# EAGLE design LM335_LTC (EAGLE 9.6.2)
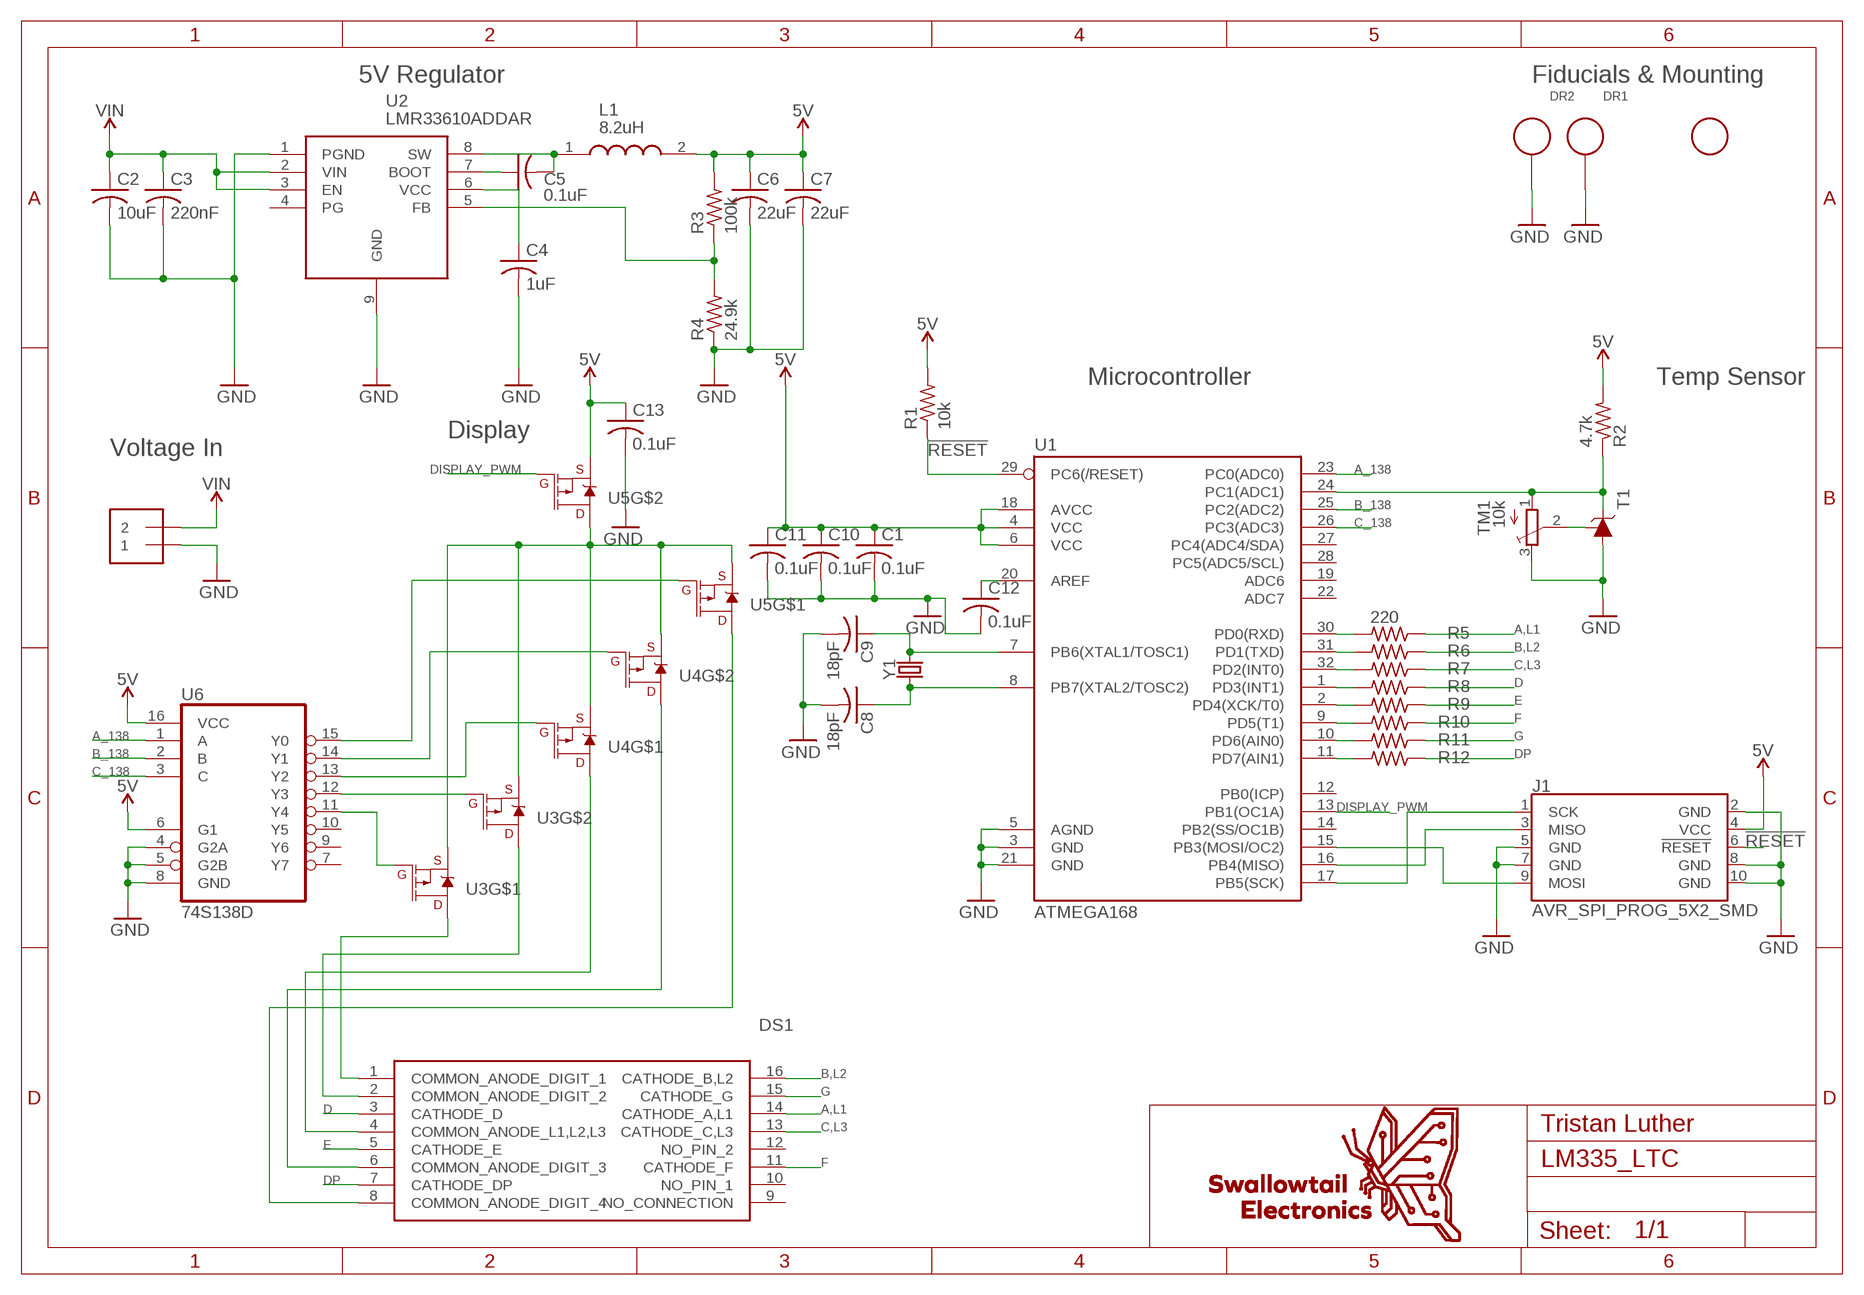
[diagram p0: schematic, sheet 1]

## Parts
C1  0.1uF  C-USC0805  [C0805]
C2  10uF  C-USC0805  [C0805]
C3  220nF  C-USC0805  [C0805]
C4  1uF  C-USC0805  [C0805]
C5  0.1uF  C-USC0805  [C0805]
C6  22uF  C-USC0805  [C0805]
C7  22uF  C-USC0805  [C0805]
C8  18pF  C-USC0805  [C0805]
C9  18pF  C-USC0805  [C0805]
C10  0.1uF  C-USC0805  [C0805]
C11  0.1uF  C-USC0805  [C0805]
C12  0.1uF  C-USC0805  [C0805]
C13  0.1uF  C-USC0805  [C0805]
DR1  3MM_DRILL_GND  [3MM_DRILL_GND]
DR2  3MM_DRILL_GND  [3MM_DRILL_GND]
DS1  LTC-4627WC  [DIPS1016W50P254L4018H725Q16N]
J1  AVR_SPI_PROG_5X2_SMD  [SAMTECH_FTSH-105-01]
L1  8.2uH  SRP5015TA-2R2M  [INDPM5752X150N]
R1  10k  R-US_R0805  [R0805]
R2  4.7k  R-US_R0805  [R0805]
R3  100k  R-US_R0805  [R0805]
R4  24.9k  R-US_R0805  [R0805]
R5  220  R-US_R0805  [R0805]
R6  220  R-US_R0805  [R0805]
R7  220  R-US_R0805  [R0805]
R8  220  R-US_R0805  [R0805]
R9  220  R-US_R0805  [R0805]
R10  220  R-US_R0805  [R0805]
R11  220  R-US_R0805  [R0805]
R12  220  R-US_R0805  [R0805]
T1  LM335  [TO92]
TM1  10k  TRIMPOTTC33X  [TC33X]
U1  ATMEGA168  [TQFP32-08]
U2  LMR33610ADDAR  [SOIC127P600X170-9N]
U3  SI1967DH-T1-E3  [SOT363_PHILIPS]
U4  SI1967DH-T1-E3  [SOT363_PHILIPS]
U5  SI1967DH-T1-E3  [SOT363_PHILIPS]
U6  74S138D  [SO16]
U$2  25-B200-02  [25−B200-02]
U$4  FIDUCIAL  [FIDUCIAL_1MM]
Y1  16MHz  CRYSTAL-16MHZSMD-5X3.2  [CRYSTAL-SMD-5X3.2-4PAD]

## Nets
5V [power]: C1.1 C6.1 C7.1 C10.1 C11.1 C13.1 J1.4(VCC) L1.2 R1.2 R2.2 R3.2 U1.4(VCC) U1.6(VCC) U1.18(AVCC) U5.4(S) U6.6(G1) U6.16(VCC)
!RESET: J1.6(!RESET) R1.1 U1.29(PC6(/RESET))
A,L1: DS1.14(CATHODE_A,L1) R5.1
A_138: U1.23(PC0(ADC0)) U6.1(A)
B,L2: DS1.16(CATHODE_B,L2) R6.1
B_138: U1.25(PC2(ADC2)) U6.2(B)
C,L3: DS1.13(CATHODE_C,L3) R7.1
C_138: U1.26(PC3(ADC3)) U6.3(C)
D: DS1.3(CATHODE_D) R8.1
DISPLAY_PWM: U1.13(PB1(OC1A)) U5.5(G)
DP: DS1.7(CATHODE_DP) R12.1
E: DS1.5(CATHODE_E) R9.1
F: DS1.11(CATHODE_F) R10.1
G: DS1.15(CATHODE_G) R11.1
GND: C1.2 C2.2 C3.2 C4.2 C6.2 C7.2 C8.2 C9.2 C10.2 C11.2 C12.2 C13.2 DR1.DR(D$1) DR2.DR(D$1) J1.2(GND) J1.5(GND) J1.7(GND) J1.8(GND) J1.10(GND) R4.1 T1.2(A) TM1.3(E) U1.3(GND) U1.5(AGND) U1.21(GND) U2.1(PGND) U2.9(GND) U6.4(G2A) U6.5(G2B) U6.8(GND) U$2.P1
N$1: C4.1 U2.6(VCC)
N$2: R3.1 R4.2 U2.5(FB)
N$3: U3.2(G) U6.11(Y4)
N$4: R2.1 T1.1(C) TM1.1(A) U1.24(PC1(ADC1))
N$5: C5.2 L1.1 U2.8(SW)
N$6: C5.1 U2.7(BOOT)
N$7: T1.3(ADJ) TM1.2(S)
N$8: C9.1 U1.7(PB6(XTAL1/TOSC1)) Y1.3
N$9: C8.1 U1.8(PB7(XTAL2/TOSC2)) Y1.1
N$10: J1.1(SCK) U1.17(PB5(SCK))
N$11: J1.3(MISO) U1.16(PB4(MISO))
N$12: J1.9(MOSI) U1.15(PB3(MOSI/OC2))
N$13: U3.5(G) U6.12(Y3)
N$14: U4.2(G) U6.13(Y2)
N$15: U4.5(G) U6.14(Y1)
N$16: U5.2(G) U6.15(Y0)
N$17: U3.1(S) U3.4(S) U4.1(S) U4.4(S) U5.1(S) U5.3(D)
N$21: C12.1 U1.20(AREF)
N$22: DS1.1(COMMON_ANODE_DIGIT_1) U3.6(D)
N$23: DS1.2(COMMON_ANODE_DIGIT_2) U3.3(D)
N$24: DS1.4(COMMON_ANODE_L1,L2,L3) U4.6(D)
N$25: DS1.6(COMMON_ANODE_DIGIT_3) U4.3(D)
N$26: DS1.8(COMMON_ANODE_DIGIT_4) U5.6(D)
N$27: R5.2 U1.30(PD0(RXD))
N$28: R6.2 U1.31(PD1(TXD))
N$29: R7.2 U1.32(PD2(INT0))
N$30: R8.2 U1.1(PD3(INT1))
N$31: R9.2 U1.2(PD4(XCK/T0))
N$32: R10.2 U1.9(PD5(T1))
N$33: R11.2 U1.10(PD6(AIN0))
N$34: R12.2 U1.11(PD7(AIN1))
VIN [power]: C2.1 C3.1 U2.2(VIN) U2.3(EN) U$2.P2
Unconnected: DS1.9(NO_CONNECTION) DS1.10(NO_PIN_1) DS1.12(NO_PIN_2) U1.12(PB0(ICP)) U1.14(PB2(SS/OC1B)) U1.19(ADC6) U1.22(ADC7) U1.27(PC4(ADC4/SDA)) U1.28(PC5(ADC5/SCL)) U2.4(PG) U6.7(Y7) U6.9(Y6) U6.10(Y5)

## Notes on the sheet
- 5V Regulator | Fiducials & Mounting
- Microcontroller | Temp Sensor
- Display
- Voltage In

## Library data of the parts
C1-C13 = Swallowtail_Passives:C-US: CAPACITOR, American symbol
DR1 DR2 = Swallowtail_ManufactingTest:3MM_DRILL_GND: Common 3mm Machine Screw Hole. Better than your standard drill! Connects to the ground of the circuit board to the enclosure.
DS1 = Swallowtail_Display:LTC-4627WC: LED Displays & Accessories 4 Digit, Red Low Current Source: Datasheet <https://www.mouser.co.uk/datasheet/2/239/lite-on_lites09386-1-1737223.pdf>; ARROW_PART_NUMBER: LTC-4627WC; DESCRIPTION: LED Displays & Accessories 4 Digit, Red Low Current; HEIGHT: 7.25mm; MANUFACTURER_NAME: Lite-On; MANUFACTURER_PART_NUMBER: LTC-4627WC; MOUSER_PART_NUMBER: 859-LTC-4627WC; MOUSER_PRICE-STOCK: https://www.mouser.co.uk/ProductDetail/Lite-On/LTC-4627WC?qs=WxFF5lh7QM2bLZnn%2FGZIkg%3D%3D
J1 = Swallowtail_Connectors:AVR_SPI_PROG_5X2: Cortex Debug Connector - 10 pin Supports JTAG debug, Serial Wire debug, and Serial Wire Viewer. PTH and SMD connector options available. General Connector Information <http://infocenter.arm.com/help/topic/com.arm.doc.faqs/attached/13634/cortex_debug_connectors.pdf> Products: PTH Connector <http://www.digikey.com/product-detail/en/cnc-tech/3220-10-0100-00/1175-1627-ND/3883661> -via Digi-Key SparkFun PSoc <https://www.sparkfun.com/products/13229> SparkFun T <https://www.sparkfun.com/products/13810>
L1 = Swallowtail_Passives:SRP5015TA-2R2M: Bourns SRP5015TA Series Shielded Wire-wound SMD Inductor with a Carbonyl Powder Core, 2.2 H Wire-Wound 4A Idc Q:10 Source: Datasheet <https://www.bourns.com/docs/Product-Datasheets/SRP5015TA.pdf>; ARROW_PART_NUMBER: SRP5015TA-2R2M; ARROW_PRICE-STOCK: https://www.arrow.com/en/products/srp5015ta-2r2m/bourns; DESCRIPTION: Bourns SRP5015TA Series Shielded Wire-wound SMD Inductor with a Carbonyl Powder Core, 2.2 H Wire-Wound 4A Idc Q:10; HEIGHT: 1.5mm; MANUFACTURER_NAME: Bourns; MANUFACTURER_PART_NUMBER: SRP5015TA-2R2M; MOUSER_PART_NUMBER: 652-SRP5015TA-2R2M; MOUSER_PRICE-STOCK: https://www.mouser.co.uk/ProductDetail/Bourns/SRP5015TA-2R2M?qs=ZwKJWZfDtNjiXC2UrFyYsA%3D%3D
R1-R12 = Swallowtail_Passives:R-US_: RESISTOR, American symbol
T1 = Swallowtail_Sensor:LM335: LM335 Linear Temp Sensor Temperature Sensor Analog, Local -40°C ~ 100°C 10mV/°K TO-92-3
TM1 = Swallowtail_Passives:TRIMPOT: SMT trimmer potentiometer part number TC33X http://www.ladyada.net/library/eagle
U1 = Swallowtail_Microcontroller:ATMEGA168: ATMEGA 168 Atmel 32-pin 8-bit micro, 16k flash. SparkFun Products SparkFun Serial Graphic LCD 128x64 <https://www.sparkfun.com/products/9351> (LCD-09351) SparkFun Graphic LCD Serial Backpack <https://www.sparkfun.com/products/9352> (LCD-09352) SparkFun Serial Graphic LCD 160x128 <https://www.sparkfun.com/products/8884> (LCD-08884); PROD_ID: IC-08594
U2 = Swallowtail_PowerManagment:LMR33610ADDAR: SIMPLE SWITCHER 3.8V to 36V, 3A Synchronous Buck Converter With Ultra-Low EMI Source: Datasheet <http://www.ti.com/lit/gpn/lmr33630>; ARROW_PART_NUMBER: LMR33630ADDAR; ARROW_PRICE-STOCK: https://www.arrow.com/en/products/lmr33630addar/texas-instruments; DESCRIPTION: SIMPLE SWITCHER 3.8V to 36V, 3A Synchronous Buck Converter With Ultra-Low EMI; HEIGHT: 1.7mm; MANUFACTURER_NAME: Texas Instruments; MANUFACTURER_PART_NUMBER: LMR33630ADDAR; MOUSER_PART_NUMBER: 595-LMR33630ADDAR; MOUSER_PRICE-STOCK: https://www.mouser.co.uk/ProductDetail/Texas-Instruments/LMR33630ADDAR?qs=r5DSvlrkXmJQkBTqgVdiDA%3D%3D
U3-U5 = Swallowtail_Transistors:SI1967DH-T1-E3: SI1967DH-T1-E3 Mfr Vishay Siliconix Series TrenchFET® Package Tape & Reel (TR) Cut Tape (CT) Digi-Reel® Part Status Active FET Type 2 P-Channel (Dual) FET Feature Logic Level Gate Drain to Source Voltage (Vdss) 20V Current - Continuous Drain (Id) @ 25°C 1.3A Rds On (Max) @ Id, Vgs 490mOhm @ 910mA, 4.5V Vgs(th) (Max) @ Id 1V @ 250µA Gate Charge (Qg) (Max) @ Vgs 4nC @ 8V Input Capacitance (Ciss) (Max) @ Vds 110pF @ 10V Power - Max 1.25W Operating Temperature -55°C ~ 150°C (TJ) Mounting Type Surface Mount Package / Case 6-TSSOP, SC-88, SOT-363 Supplier Device Package SC-70-6 (SOT-363)
U6 = Swallowtail_Logic:74*138: 3-line to 8-line DECODER/DEMULTIPLEXER
U$2 = Swallowtail_Connectors:25-B200-02: 25-B200-02 2 Circuit 0.374" (9.50mm) Barrier Block Connector Screws with Captive Plate
U$4 = Swallowtail_ManufactingTest:FIDUCIAL: For use by pick and place machines to calibrate the vision/machine, 1mm By microbuilder.eu
Y1 = Swallowtail_Crystals:CRYSTAL-16MHZ: 16MHz Crystal Digikey Example <http://www.digikey.com/product-search/en?keywords=535-9122-1-ND> Frequency: 16MHz Frequency Stability: ±50ppm Frequency Tolerance: ±20ppm Load Capacitance: 18pF SparkFun Products: Pro Micro -5V/16MHz <https://www.sparkfun.com/products/12640> SparkFun Serial Enabled LCD Kit <https://www.sparkfun.com/products/10097>; PROD_ID: XTAL-08218; SF_ID: COM-00094

## Net classes
1 power: width 0.254 mm

## Board
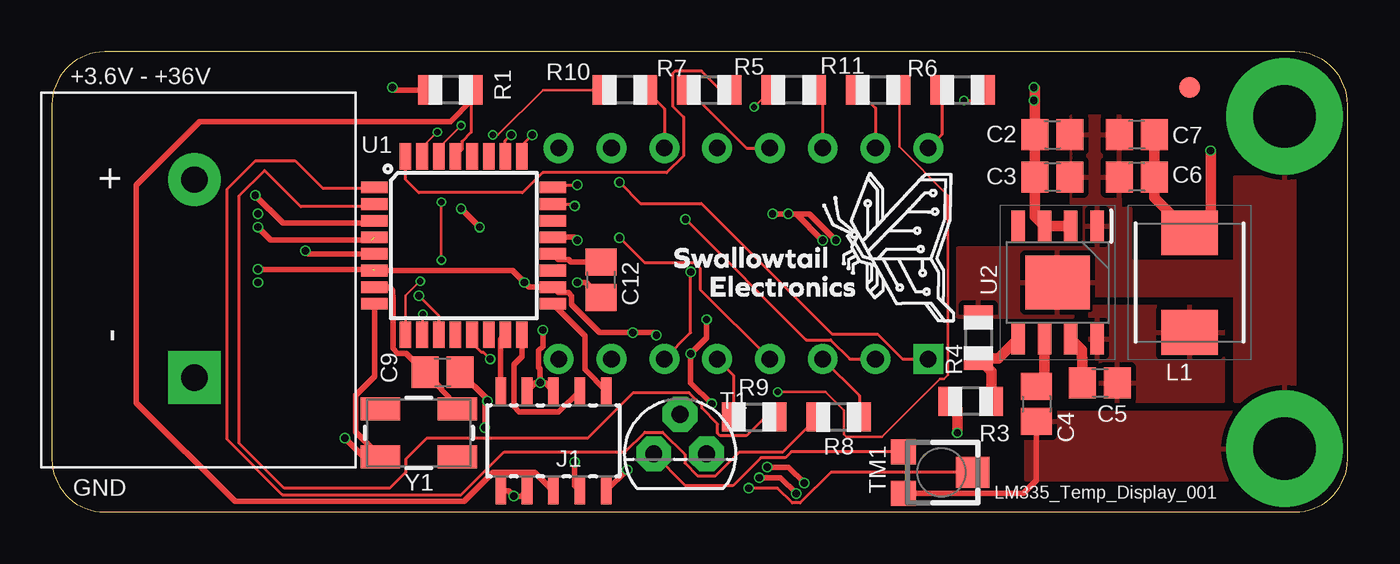
[diagram p1: board, top side]
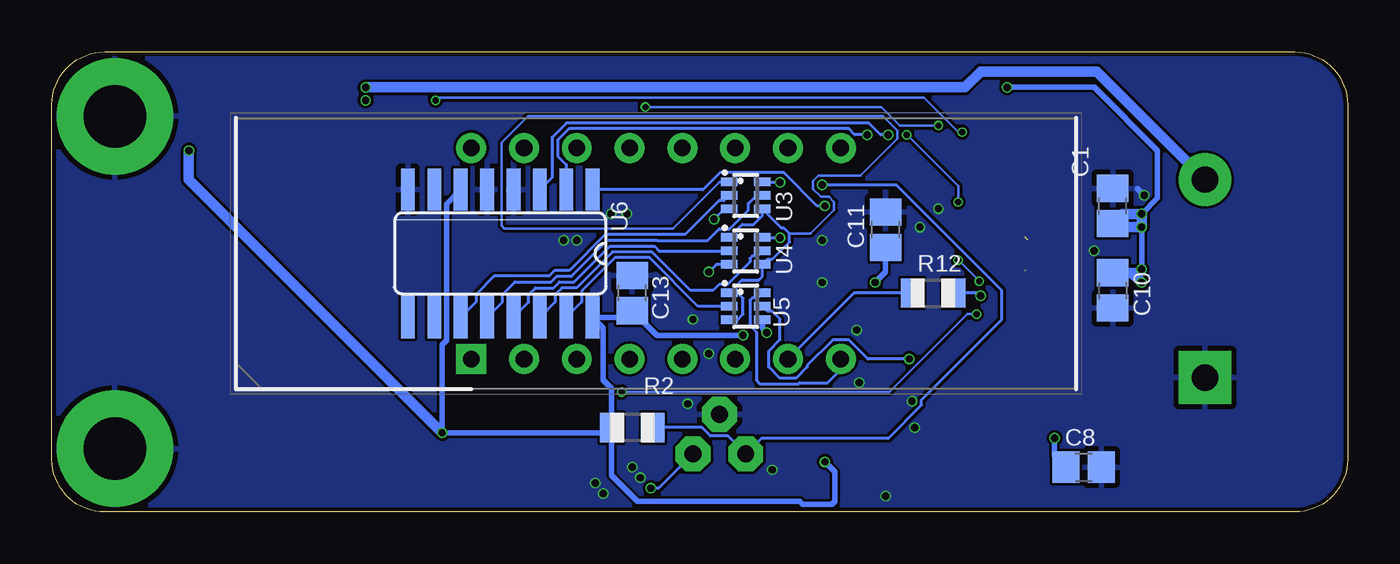
[diagram p2: board, bottom side, seen from below]

Size 62.34 x 22.15 mm. Coordinates in mm from the lower left corner, seen from the top.
Outline: 59.8,22.15 2.54,22.15 arc90 0,19.61 0,2.54 arc90 2.54,0 59.8,0 arc90 62.34,2.54 62.34,19.61 arc90 59.8,22.15
Copper layers (1*16): Top 0.035mm / dielectric 1.6mm / Bottom 0.035mm
Design rules "jlcpcb-eagle": minimum track width 5mil, minimum drill 0.3mm, track to track 5mil, track to pad 5mil, pad to pad 5mil, via to via 5mil, smd to smd 5mil, copper to edge 0.2mm, drill to drill 6mil, minimum pad ring 10mil, minimum via ring 3mil, stop-mask expansion 4mil, vias tented up to drill 0mil, thermal gap 10mil

### Footprints (pad centres in the part's own frame; a part is rotated, then mirrored left to right if it is on the bottom)
C0805 = smd 1.3 x 1.5: 1 -0.85,0; 2 0.85,0
3MM_DRILL_GND = drill 3 pad 5.6: DR 0,0.127
DIPS1016W50P254L4018H725Q16N = drill 0.8 pad 1.2 square: 1 0,0 | drill 0.8 pad 1.2: 2 0,-2.54; 3 0,-5.08; 4 0,-7.62; 5 0,-10.16; 6 0,-12.7; 7 0,-15.24; 8 0,-17.78; 9 10.16,-17.78; 10 10.16,-15.24; 11 10.16,-12.7; 12 10.16,-10.16; 13 10.16,-7.62; 14 10.16,-5.08; 15 10.16,-2.54; 16 10.16,0
SAMTECH_FTSH-105-01 = smd 0.508 x 1.27: 1 -2.54,-2.413; 2 -2.54,2.413; 3 -1.27,-2.413; 4 -1.27,2.413; 5 0,-2.413; 6 0,2.413; 7 1.27,-2.413; 8 1.27,2.413; 9 2.54,-2.413; 10 2.54,2.413
INDPM5752X150N = smd 2.15 x 2.7: 1 -2.4,0; 2 2.4,0
R0805 = smd 1.1 x 1.4: 1 -1,0; 2 1,0
TO92 = drill 0.813 pad 1.676 octagon: 1 -1.27,0; 2 0,1.905; 3 1.27,0
TC33X = smd 1.2 x 1.2: 1 -1,-1.825; 3 1,-1.825 | smd 1.5 x 1.6: 2 0,1.5
TQFP32-08 = smd 1.27 x 0.559: 1 -4.293,2.8; 2 -4.293,2; 3 -4.293,1.2; 4 -4.293,0.4; 5 -4.293,-0.4; 6 -4.293,-1.2; 7 -4.293,-2; 8 -4.293,-2.8; 17 4.293,-2.8; 18 4.293,-2; 19 4.293,-1.2; 20 4.293,-0.4; 21 4.293,0.4; 22 4.293,1.2; 23 4.293,2; 24 4.293,2.8 | smd 0.559 x 1.27: 9 -2.8,-4.293; 10 -2,-4.293; 11 -1.2,-4.293; 12 -0.4,-4.293; 13 0.4,-4.293; 14 1.2,-4.293; 15 2,-4.293; 16 2.8,-4.293; 25 2.8,4.293; 26 2,4.293; 27 1.2,4.293; 28 0.4,4.293; 29 -0.4,4.293; 30 -1.2,4.293; 31 -2,4.293; 32 -2.8,4.293
SOIC127P600X170-9N = smd 1.525 x 0.65: 1 -2.712,1.905; 2 -2.712,0.635; 3 -2.712,-0.635; 4 -2.712,-1.905; 5 2.712,-1.905; 6 2.712,-0.635; 7 2.712,0.635; 8 2.712,1.905 | smd 2.6 x 3.1: 9 0,0
SOT363_PHILIPS = smd 0.4 x 0.8: 1 -0.65,-0.8; 2 0,-0.8; 3 0.65,-0.8; 4 0.65,0.8; 5 0,0.8; 6 -0.65,0.8
SO16 = smd 0.66 x 2.032: 1 -4.445,-3.073; 2 -3.175,-3.073; 3 -1.905,-3.073; 4 -0.635,-3.073; 5 0.635,-3.073; 6 1.905,-3.073; 7 3.175,-3.073; 8 4.445,-3.073; 9 4.445,3.073; 10 3.175,3.073; 11 1.905,3.073; 12 0.635,3.073; 13 -0.635,3.073; 14 -1.905,3.073; 15 -3.175,3.073; 16 -4.445,3.073
25−B200-02 = drill 1.27 pad 2.54 square: P1 0,0 | drill 1.27 pad 2.54: P2 9.525,0
FIDUCIAL_1MM = smd 1 x 1: 1 0,0
CRYSTAL-SMD-5X3.2-4PAD = smd 1.9 x 1.1: 1 -1.85,-1.15; 2 1.85,-1.15; 3 1.85,1.15; 4 -1.85,1.15

### Placement (x,y rotation side)
C1  11.3,14.73 90 bottom
C2  48.13,18.16 0 top
C3  48.13,16.13 0 top
C4  47.37,5.21 270 top
C5  50.42,6.22 0 top
C6  52.2,16.13 180 top
C7  52.2,18.16 180 top
C8  12.7,2.16 0 bottom
C9  18.8,6.73 0 top
C10  11.3,10.67 270 bottom
C11  22.23,13.59 90 bottom
C12  26.42,11.18 270 top
C13  34.42,10.54 90 bottom
DR1  59.31,18.92 0 top
DR2  59.31,2.92 0 top
DS1  42.16,7.37 90 bottom
J1  24.13,3.43 180 top
L1  54.74,11.05 90 top
R1  19.18,20.32 180 top
R2  34.42,4.06 180 bottom
R3  44.2,5.33 180 top
R4  44.58,8.38 270 top
R5  35.69,20.32 180 top
R6  43.81,20.32 0 top
R7  31.62,20.32 0 top
R8  37.85,4.57 180 top
R9  33.78,4.57 0 top
R10  27.56,20.32 180 top
R11  39.75,20.32 0 top
R12  19.94,10.54 0 bottom
T1  30.23,2.79 0 top
TM1  42.8,1.91 270 top
U1  19.81,12.83 0 top
U2  48.39,11.05 270 top
U3  28.96,15.24 270 bottom
U4  28.96,12.57 270 bottom
U5  28.96,9.91 270 bottom
U6  40.77,12.45 180 bottom
U$2  6.86,6.48 90 top
U$3  [SWALLOWTAIL_LOGO_SMALL]  29.97,9.14 0 top
U$4  54.74,20.45 0 top
Y1  17.65,3.81 0 top

### Tracks (layer width: path | path; a pad name or v marks a point on that pad's centre or on a via)
5V  (via drill 0.35)  (2 unrouted)
  Top 0.254: R1.2 16.51,20.32 v16.38,20.45 | v9.91,13.72 10.52,13.1 15.39,13.1 | v9.91,11.68 15.46,11.68 | J1.4 25.15,1.27 v25.15,2.41 | v29.08,8.51 28.96,8.64 v27.94,8.64 26.35,8.64 24.99,9.99 24.99,10.41 24.84,10.56 24.37,10.56 U1.18 22.95,10.83 v22.73,11.05 22.16,11.63 U1.6
  Top 0.508: C7.1 C6.1 53.05,15.14 L1.2 55.75,14.46 v55.75,17.4 | R3.2 43.56,4.97 v43.56,3.81
  Bottom 0.254: v22.73,11.05 22.23,11.56 C11.1 | v16.38,20.45 12.19,20.45 9.14,17.4 9.14,15.11 v9.91,14.35 | v9.91,13.72 v9.91,11.68 | U5.4 28.16,8.85 v27.94,8.64 | R2.2 35.42,5.95 35.81,6.35 35.81,8.87 U6.16 34.73,9.37 C13.1 33.23,8.51 v29.08,8.51 | U6.6 43.36,14.83 43.36,8.25 43.56,8.05 v43.56,3.81 35.67,3.81 R2.2 | v25.15,2.41 24.81,2.08 24.66,1.93 24.66,0.52 24.81,0.37 26.22,0.37 26.36,0.51 34.16,0.51 35.42,1.76 R2.2
  Bottom 0.508: v43.56,3.81 55.75,16 v55.75,17.4 | v9.91,11.68 10.07,11.52 C10.1 10.38,11.52 v9.91,11.05 | v9.91,14.35 10.83,14.35 C1.1 11.14,13.72 v9.91,13.72 v9.91,14.35
!RESET
  Top 0.152: U1.29 19.73,17.44 19.73,17.84 20.18,18.29 R1.1
  Top 0.254: J1.6 24.11,1.02 23.22,1.91 21.23,1.91 19.83,0.51 8.82,0.51 4.06,5.26 4.06,15.75 7.11,18.8 19.18,18.8 20.18,19.8 R1.1
A,L1
  Top 0.152: R5.1 37.08,19.92 DS1.14
A_138  (via drill 0.35)
  Top 0.152: U1.23 25.05,14.83 v25.15,14.73
  Bottom 0.152: v25.15,14.73 25.52,14.73 27.12,16.33 30.2,16.33 31.01,15.52 U6.1
B,L2
  Top 0.152: R6.1 42.81,18.18 DS1.16
B_138  (via drill 0.35)
  Top 0.152: U1.25 22.61,17.66 v23.11,18.16
  Bottom 0.152: v23.11,18.16 23.71,18.16 24,18.45 37.47,18.45 38.01,17.91 38.01,17.14 37.59,16.73 U6.2
C,L3
  Top 0.152: R7.1 33.42,17.53 DS1.13
C_138  (via drill 0.35)
  Top 0.152: U1.26 21.81,17.88 v22.1,18.16
  Bottom 0.152: v22.1,18.16 22.47,18.16 23.04,18.73 37.58,18.73 38.29,18.02 38.29,16.09 U6.3
D
  Top 0.152: DS1.3 38.85,5.6 R8.1
DISPLAY_PWM  (via drill 0.35)
  Top 0.152: v21.08,7.37 20.75,7.7 20.65,7.7 20.21,8.13 U1.13
  Bottom 0.152: U5.5 27.91,9.66 27.67,9.66 27.3,9.29 27.3,8.3 27.85,7.75 27.85,6.98 27.31,6.44 26.54,6.44 26,6.98 26,7.05 24.77,8.29 24,8.29 23.08,7.37 v21.08,7.37
DP
  Bottom 0.152: R12.1 23.75,10.54 DS1.7
E
  Top 0.152: DS1.5 32.78,6.59 R9.1
F
  Top 0.152: R10.1 29.46,19.41 DS1.11
G
  Top 0.152: R11.1 39.62,19.45 DS1.15
GND  (via drill 0.35)
  Top 0.254: J1.7 23.24,6.22 v23.5,6.22 | J1.5 23.75,6.22 v23.5,6.22 | J1.10 21.97,1.02 v22.23,0.76 22.61,0.76 J1.8 | J1.2 v27.69,2.03 | v9.78,15.24 11.12,13.9 15.39,13.9 U1.3 | U1.21 25.13,13.23 v25.27,13.08 | C9.2 20.95,5.42 v20.95,5.33 20.83,5.21 v20.83,4.06 | v34.42,2.16 35.43,2.16 v36.2,1.4 | v34.04,1.65 35.05,1.65 v35.81,0.89 | v31.5,9.27 31.5,8.38 v30.73,7.62 30.73,6.22 v31.75,5.21 | v12.19,12.57 12.34,12.43 U1.5 | v19.68,14.61 v20.57,13.72 | v35.43,14.35 36.45,14.35 v37.72,13.08 | v34.67,14.35 35.81,14.35 v37.08,13.08 | v23.62,8.76 23.62,7.98 23.41,7.77 23.41,6.96 23.5,6.88 v23.5,6.22 | TM1.3 43.39,0.91 43.39,0.9 46.75,0.9 47.37,1.52 C4.2 | v25.27,11.05 25.69,11.05 C12.2
  Bottom 0.254: v9.78,15.24 10.12,15.58
  pour Top: 49.02,19.05 49.02,14.86 49.66,14.86 49.66,12.7 43.56,12.7 43.56,9.4 49.15,9.4 49.15,10.41 56.9,10.41 56.9,5.33 59.82,5.33 59.82,16.13 56.9,16.13 56.9,12.06 51.94,12.06 51.94,14.61 51.44,14.61 51.44,19.05
  pour Top: 46.86,4.83 56.9,4.83 56.9,5.33 59.82,5.33 59.82,1.52 46.86,1.52
  pour Bottom: 59.82,0 2.54,0 arc-90 0,2.54 0,19.56 arc-90 2.54,22.1 59.82,22.1 arc-90 62.36,19.56 62.36,2.54 arc-90
N$1
  Top 0.508: U2.6 47.75,6.44 C4.1
N$2
  Top 0.508: U2.5 45.53,7.38 R4.2 45.2,6.76 R3.1
N$3
  Bottom 0.152: U3.2 30,14.99 30.24,14.99 31.87,13.36 33.12,13.36 35.71,13.36 37.44,11.63 38.15,11.63 38.43,11.35 41.05,11.35 41.94,10.47 41.94,10.11 U6.11
N$4  (via drill 0.35)
  Top 0.152: U1.24 24.23,15.75 v25.27,15.75 | TM1.1 35.57,2.9 35.28,2.62 34.11,2.62 32.77,1.27 30.48,1.27 T1.1
  Bottom 0.152: v25.27,15.75 21.72,15.75 16.64,10.67 16.64,9.27 20.5,5.41 20.5,5.15 22.1,3.54 28.2,3.54 T1.1 29.82,3.66 30.66,3.66 31.06,4.06 R2.1
N$5
  pour Top: 49.91,9.91 49.91,7.37 50.42,7.37 50.42,5.33 56.39,5.33 56.39,9.91
N$6
  Top 0.508: U2.7 49.56,7.8 49.56,7.41 49.57,7.4 C5.1
N$7  (via drill 0.35)
  Top 0.152: TM1.2 37.47,1.91 36,0.43 35.63,0.43 34.92,1.14 v33.53,1.14
  Bottom 0.152: T1.3 33.15,1.14 v33.53,1.14
N$8
  Top 0.254: Y1.3 19.5,5.12 18.74,5.88 18.74,5.93 C9.1 17.03,7.64 16.63,7.64 16.41,7.86 16.41,10.41 16.38,10.44 16.38,10.67 16.22,10.83 U1.7
N$9  (via drill 0.35)
  Top 0.254: U1.8 15.52,6.54 14.6,5.62 14.6,3.86 Y1.1 14.99,2.66 v14.1,3.56
  Bottom 0.254: v14.1,3.56 14.1,2.71 C8.1
N$10
  Top 0.254: J1.1 25.65,6.86 25.65,8.48 U1.17
N$11
  Top 0.254: J1.3 24.38,4.83 22.48,4.83 22.23,5.08 22.23,7.11 22.61,7.5 U1.16
N$12
  Top 0.254: J1.9 21.59,8.31 U1.15
N$13
  Bottom 0.152: U6.12 40.66,10.11 40.66,10.47 40.06,11.07 38.31,11.07 38.03,11.35 37.33,11.35 35.6,13.08 33.24,13.08 33.23,13.08 30.79,13.08 30.24,13.63 29.75,13.63 28.83,14.54 28.83,14.86 28.45,15.24 U3.5
N$14
  Bottom 0.152: U6.13 39.4,10.11 39.4,10.47 39.07,10.79 38.2,10.79 37.92,11.07 37.21,11.07 35.48,12.8 33.35,12.8 33.12,12.57 U4.2
N$15
  Bottom 0.152: U4.5 28.4,12.33 28.64,12.33 28.76,12.21 28.76,12.03 29.83,10.96 30.24,10.96 30.53,10.67 31.61,10.67 33.47,12.52 35.37,12.52 37.1,10.79 37.8,10.79 38.12,10.47 38.12,10.11 U6.14
N$16
  Bottom 0.152: U6.15 36.85,10.11 36.85,10.64 35.25,12.24 33.58,12.24 31.25,9.91 U5.2
N$17
  Bottom 0.127: U3.1 29.78,15.88 30.23,15.88 32.45,13.65 40.58,13.65 40.7,13.78 40.7,17.78 39.43,19.05 22.35,19.05 21.65,18.35 21.65,17.97 23.43,16.19 25.46,16.19 25.72,15.94 25.72,15.56 25.34,15.18 24.96,15.18 24.7,14.92 24.7,14.54 25.84,13.4 26.8,13.4 26.85,13.4
  Bottom 0.152: U5.3 29.35,9.26 29.08,9.53 29.08,10.29 29.35,10.56 U5.1 29.14,11.18 28.32,11.18 28.16,11.34 U4.4 27.91,12.17 27.67,12.17 26.85,12.99 26.85,13.4 27.12,13.66 27.23,13.66 U3.4 28.16,14.26 28.57,13.84 29.14,13.84 U4.1
N$21
  Top 0.254: U1.20 24.37,12.16 24.84,12.16 24.98,12.03 C12.1
N$22  (via drill 0.35)
  Top 0.152: v27.3,15.88 28.32,14.86 31.24,14.86 37.53,8.57 39.73,8.57 40.93,7.37 DS1.1
  Bottom 0.152: U3.6 28.14,15.88 v27.3,15.88
N$23  (via drill 0.35)
  Top 0.152: v30.48,14.1 36.29,8.29 37.47,8.29 38.39,7.37 DS1.2
  Bottom 0.152: U3.3 29.99,14.59 v30.48,14.1
N$24  (via drill 0.35)
  Top 0.152: v27.3,13.21 28.5,12.01 30.92,12.01 31.19,11.74 31.19,10.72 DS1.4
  Bottom 0.152: U4.6 28.14,13.21 v27.3,13.21
N$25  (via drill 0.35)
  Top 0.152: DS1.6 30.73,8.64 v30.73,11.56
  Bottom 0.152: U4.3 30.37,11.92 v30.73,11.56
N$26
  Bottom 0.152: U5.6 28.4,10.31 28.64,10.31 28.76,10.19 28.76,8.97 28.45,8.66 28.45,6.35 28.26,6.16 26.43,6.16 26.37,6.22 25.02,6.22 24.38,6.86 DS1.8
N$27  (via drill 0.3)
  Top 0.127: v19.68,18.61 18.67,17.59 18.67,17.14 U1.30 | v33.78,19.49 34.61,20.32 R5.2
  Bottom 0.127: v19.68,18.61 21.53,18.61 22.42,19.49 v33.78,19.49
N$28  (via drill 0.3)
  Top 0.127: v18.54,18.29 17.84,17.59 17.84,17.14 U1.31 | v43.88,19.81 44.26,19.81 44.77,20.32 R6.2
  Bottom 0.127: v18.54,18.29 18.73,18.29 20.38,19.94 43.75,19.94 v43.88,19.81
N$29
  Top 0.152: R7.2 32.16,20.32 31.26,21.22 29.99,21.22 29.87,21.1 29.87,19.54 30.39,19.02 30.39,17.14 29.57,16.33 23.61,16.33 22.64,15.37 17.65,15.37 17.01,16.01 U1.32
N$30
  Top 0.152: R8.2 35.17,2.9 33.07,2.9 31.93,1.75 31.07,1.75 30.45,2.36 30.45,2.77 29.39,3.83 28.52,3.83 27.59,2.9 21.75,2.9 19.7,0.84 11.09,0.84 8.43,3.49 8.43,15.56 9.79,16.92 11.7,16.92 13.04,15.57 15.47,15.57 U1.1
N$31
  Top 0.152: R9.2 34.32,4.57 33.42,3.67 32.15,3.67 32.03,3.79 32.03,4.24 31.27,5 31.27,5.13 30.66,5.74 27.96,5.74 25.78,3.56 18.03,3.56 17.02,2.54 17.02,1.91 16.26,1.14 11.18,1.14 9.02,3.3 9.02,15.24 10.22,16.45 11.97,14.7 15.39,14.7 U1.2
N$32  (via drill 0.3)
  Top 0.127: v17.72,11.11 17.02,10.41 17.02,8.57 U1.9 | v18.73,14.92 v18.73,12.13 | v21.21,18.16 21.46,18.16 23.62,20.32 R10.2
  Bottom 0.127: v18.73,12.13 v17.72,11.11 | v18.73,14.92 18.73,15.68 v21.21,18.16
N$33  (via drill 0.3)
  Top 0.127: v17.84,9.53 17.84,8.57 U1.10 | v34.92,5.78 37.21,5.78 38.1,4.89 38.1,3.75 38.23,3.62 39.94,3.62 42.74,6.41 42.93,6.41 43.12,6.6 43.12,15.24 40.77,17.59 40.77,20.32 R11.2
  Bottom 0.127: v17.84,9.53 18.29,9.53 22.04,5.78 v34.92,5.78
N$34  (via drill 0.35)
  Top 0.152: v17.65,10.41 18.61,9.46 U1.11
  Bottom 0.152: v17.65,10.41 17.78,10.54 R12.2
VIN  (via drill 0.35)
  Top 0.508: U2.2 U2.3 47.28,14.23 C3.1 C2.1 47.28,19.77 | 47.28,19.77 v47.24,19.81 | v47.24,20.45 47.28,20.41 47.28,19.77
  Bottom 0.508: v47.24,20.45 18.41,20.45 17.65,21.21 12.06,21.21 U$2.P2

### Text on the board
tNames: +3.6V - +36V | - + | GND | LM335_Temp_Display_001